# EAGLE design RPiCluster-Power-LED (EAGLE 5.12)
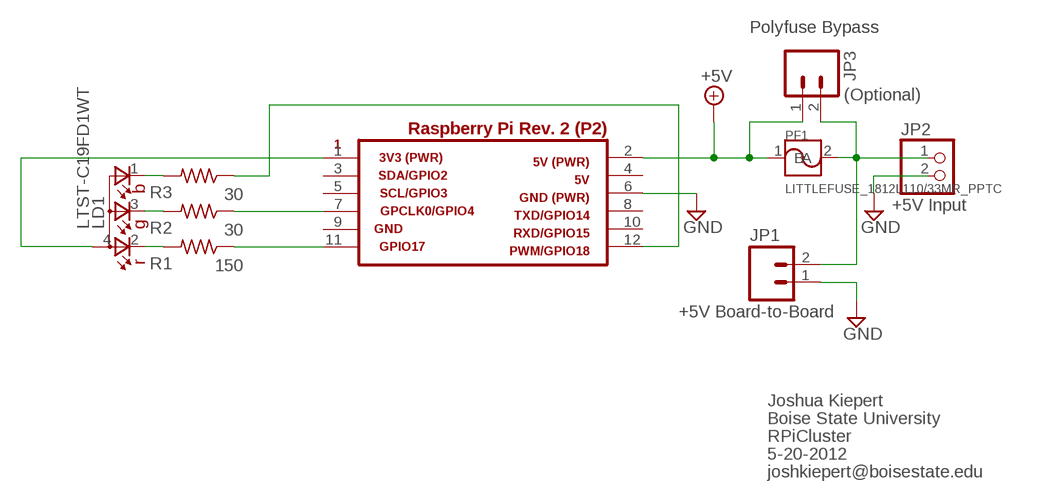
[diagram p0: schematic, sheet 1]

## Parts
JP1  M02PTH  [1X02]
JP2  PINHD-1X2/90  [1X02/90]
JP3  M02PTH  [1X02]
LD1  LTST-C19FD1WT  [LTST-C19FD1WT]
PF1  LITTLEFUSE_1812L110/33MR_PPTC  [C1812]
R1  150  R-US_R0603  [R0603]
R2  30  R-US_R0603  [R0603]
R3  30  R-US_R0603  [R0603]
RPI  P2  RASPI_GPIO_HEADER_P2(1-12)  [RASPBERRYPI_GPIO_HEADER(1-12)]

## Nets
+5V: JP3.1 PF1.1(A) RPI.2
BLUE_LED: R3.1 RPI.12
GND: JP1.1 JP2.2 RPI.6
GREEN_LED: R2.1 RPI.7
N$1: JP1.2 JP2.1 JP3.2 PF1.2(B)
N$4: LD1.2(CRED) R1.2
N$5: LD1.3(CGREEN) R2.2
N$6: LD1.1(CBLUE) R3.2
N$8: LD1.4(VCOM) RPI.1
RED_LED: R1.1 RPI.11
Unconnected: RPI.3 RPI.4 RPI.5 RPI.8 RPI.9 RPI.10

## Notes on the sheet
- Polyfuse Bypass
- (Optional)
- +5V Input
- +5V Board-to-Board
- Joshua Kiepert
- Boise State University
- RPiCluster
- 5-20-2012
- joshkiepert@boisestate.edu

## Library data of the parts
JP1 JP3 = SparkFun:M02: Header 2 Standard 2-pin 0.1" header. Use with straight break away headers (SKU : PRT-00116), right angle break away headers (PRT-00553), swiss pins (PRT-00743), machine pins (PRT-00117), and female headers (PRT-00115). Molex polarized connector foot print use with SKU : PRT-08233 with associated crimp pins and housings.
JP2 = pinhead:PINHD-1X2: PIN HEADER
LD1 = Dr_Loos_Laboratory_Complete:LTST-C19FD1WT: LITE-ON Technology Corporation RGB LED LTST-C19FD1WT (Common Anode) White Diffused Lens Size: 2.1x1.6 mm Digi-Key Part Number: 160-2022-1-ND <http://www.digikey.com/product-detail/en/LTST-C19FD1WT/160-2022-1-ND/3711419> Datasheet: LTST-C19FD1WT <http://media.digikey.com/pdf/Data%20Sheets/Lite-On%20PDFs/LTST-C19FD1WT.pdf>
PF1 = dcgi:LITTLEFUSE_1812L110/33MR_PPTC: LittleFuse Inc 1812L110/33MR PPTC Features: *Hold Current 1.1A *Trip Current 1.95A * Max Voltage 33V * Trip Time 0.5s Datasheets: LittleFuse Inc <http://www.littelfuse.com/data/en/Data_Sheets/Littelfuse_PTC_1812L.pdf> Digi-Key: F3486CT-ND <http://www.digikey.com/product-detail/en/1812L110%2F33MR/F3486CT-ND/2240058>
R1-R3 = rcl:R-US_: RESISTOR, American symbol
RPI = Dr_Loos_Laboratory_Complete:RASPI_GPIO_HEADER_P2(1-12): Raspberry Pi Rev. 2 P2 Header (pins 1-12)

## Board
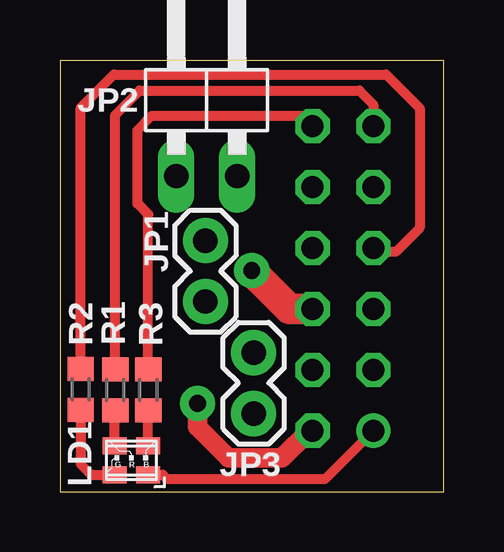
[diagram p1: board, top side]
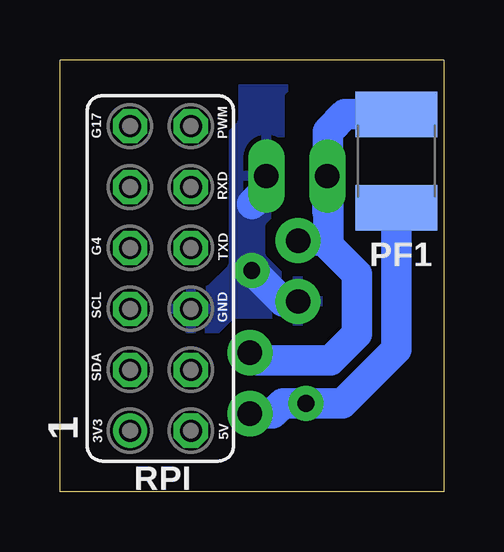
[diagram p2: board, bottom side, seen from below]

Size 16 x 18 mm. Coordinates in mm from the lower left corner, seen from the top.
Outline: 16,0 16,18 0,18 0,0 16,0
Copper layers (1*16): Top 0.035mm / dielectric 1.5mm / Bottom 0.035mm
Design rules "default *": minimum track width 10mil, minimum drill 24mil, track to track 8mil, track to pad 8mil, pad to pad 8mil, via to via 8mil, smd to smd 8mil, copper to edge 40mil, drill to drill 8mil, minimum pad ring 10mil, minimum via ring 15mil, stop-mask expansion 4mil, vias tented up to drill 0mil, thermal gap 8mil
tRestrict: area 10.5,5.1 to 13.1,16.5
bRestrict: area 2.2,11.5 to 6.5,17; area -0.1,0 to 9.3,12; area -0.1,11.3 to 6.2,17.8; area 8.6,0 to 15.6,17.7

### Footprints (pad centres in the part's own frame; a part is rotated, then mirrored left to right if it is on the bottom)
1X02 = drill 1.016 pad 1.88 round: 1 0,0; 2 2.54,0
1X02/90 = drill 1.016 long: 1 -1.27,-3.81; 2 1.27,-3.81
LTST-C19FD1WT = smd 1 x 0.7: 1 0.7,0.6; 2 -0.7,0.6; 3 -0.7,-0.6; 4 0.7,-0.6
C1812 = smd 1.9 x 3.4: 1 -1.95,0; 2 1.95,0
R0603 = smd 1 x 1.1: 1 -0.85,0; 2 0.85,0
RASPBERRYPI_GPIO_HEADER(1-12) = drill 0.914 round: 1 -6.35,1.27 | drill 0.914 octagon: 2 -6.35,-1.27; 3 -3.81,1.27; 4 -3.81,-1.27; 5 -1.27,1.27; 6 -1.27,-1.27; 7 1.27,1.27; 8 1.27,-1.27; 9 3.81,1.27; 10 3.81,-1.27; 11 6.35,1.27; 12 6.35,-1.27

### Placement (x,y rotation side)
JP1  6.07,7.92 90 top
JP2  6.12,16.97 0 top
JP3  8.08,3.25 90 top
LD1  2.98,1.3 0 top
PF1  1.97,13.78 90 bottom
R1  2.31,4.24 270 top
R2  0.87,4.27 270 top
R3  3.69,4.24 270 top
RPI  11.81,8.89 90 bottom

### Tracks (layer width: path | path; a pad name or v marks a point on that pad's centre or on a via)
+5V  (via drill 0.7)
  Top 0.813: RPI.2 10.41,2.54 9.27,1.4 7.04,1.4 5.74,2.69 v5.74,3.68
  Bottom 1.27: PF1.1 1.97,5.93 4.21,3.68 v5.74,3.68 6.71,3.68 7.14,3.25 JP3.1
BLUE_LED
  Top 0.406: RPI.12 10.16,15.62 10.11,15.67 3.83,15.67 3.23,15.07 3.23,12.01 3.69,11.55 R3.1
GND  (via drill 0.7)
  Top 0.406: 8.03,8.53 8.34,8.85
  Top 1.27: RPI.6 9.57,7.62 8.34,8.85 8,9.2
  Bottom 1.27: 7.97,9.25 v8,9.22 6.71,7.92 JP1.1 | JP2.2 7.39,12.61 8,12
  pour Bottom: -0.89,-1.27 -0.89,19.05 16.89,19.05 16.89,-1.27
GREEN_LED
  Top 0.406: RPI.7 13.24,10 14,10 15,11 15,16 13.61,17.39 2.24,17.39 0.87,16.02 R2.1
N$1
  Bottom 1.27: JP2.1 4.82,13.19 | JP2.1 4.85,11.68 | PF1.2 4.11,15.73 4.83,15.01 4.83,13.18 JP2.1 | 4.8,10.26 3.61,9.07 3.61,6.58 4.72,5.46 7.75,5.46 JP3.2 | 4.8,10.26 4.8,13.11 JP2.1 | JP1.2 5,10.46 4.8,10.26
N$4
  Top 0.406: LD1.2 2.28,3.36 R1.2
N$5
  Top 0.406: R2.2 0.87,1.14 1.31,0.7 LD1.3
N$6
  Top 0.406: LD1.1 3.68,3.38 R3.2
N$8
  Top 0.406: RPI.1 11.08,0.54 4.45,0.54 4.29,0.7 LD1.4
RED_LED
  Top 0.406: R1.1 2.31,15.71 3.32,16.72 12.49,16.72 13.07,16.14 RPI.11